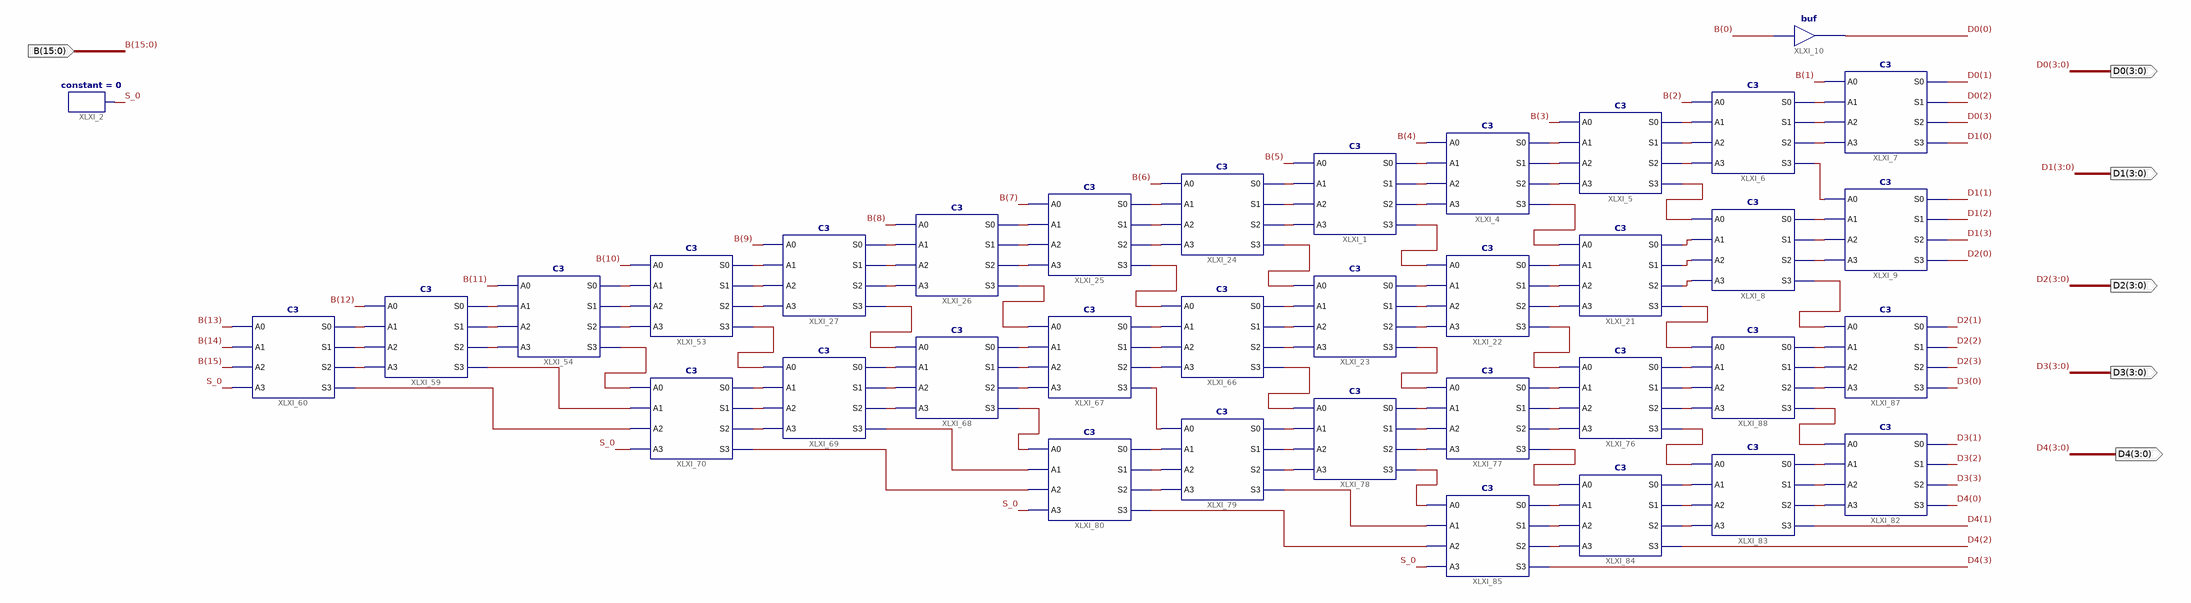
[diagram p0: schematic sheet 1]
// Xilinx ISE schematic bin2bcd_16.sch (spartan3e) as structural Verilog: 36 symbols, 6 ports
module bin2bcd_16 (
  input  [15:0] B,
  output [3:0] D1,
  output [3:0] D0,
  output [3:0] D2,
  output [3:0] D3,
  output [3:0] D4
);

  wire S_0, XLXN_22, XLXN_23, XLXN_24, XLXN_25, XLXN_26, XLXN_27, XLXN_28, XLXN_29, XLXN_30, XLXN_31,
       XLXN_32, XLXN_33, XLXN_39, XLXN_41, XLXN_42, XLXN_43, XLXN_134, XLXN_135, XLXN_136, XLXN_137,
       XLXN_138, XLXN_139, XLXN_140, XLXN_141, XLXN_142, XLXN_143, XLXN_144, XLXN_145, XLXN_146, XLXN_147,
       XLXN_148, XLXN_149, XLXN_150, XLXN_151, XLXN_152, XLXN_153, XLXN_154, XLXN_155, XLXN_156, XLXN_157,
       XLXN_186, XLXN_187, XLXN_188, XLXN_189, XLXN_190, XLXN_191, XLXN_192, XLXN_193, XLXN_194, XLXN_195,
       XLXN_196, XLXN_197, XLXN_198, XLXN_199, XLXN_200, XLXN_229, XLXN_230, XLXN_231, XLXN_232, XLXN_233,
       XLXN_234, XLXN_235, XLXN_236, XLXN_237, XLXN_238, XLXN_239, XLXN_240, XLXN_249, XLXN_250, XLXN_251,
       XLXN_252, XLXN_253, XLXN_254, XLXN_255, XLXN_256, XLXN_257, XLXN_271, XLXN_272, XLXN_273, XLXN_274,
       XLXN_275, XLXN_276, XLXN_294, XLXN_295, XLXN_296, XLXN_297, XLXN_298, XLXN_299, XLXN_300, XLXN_301,
       XLXN_302, XLXN_303, XLXN_304, XLXN_305, XLXN_306, XLXN_307, XLXN_308, XLXN_309, XLXN_310, XLXN_311,
       XLXN_312, XLXN_313, XLXN_314, XLXN_315, XLXN_316, XLXN_317, XLXN_318, XLXN_319, XLXN_320, XLXN_321,
       XLXN_322, XLXN_323, XLXN_335, XLXN_336, XLXN_337, XLXN_338, XLXN_339;

  constant #(.CValue("0")) XLXI_2 (.O(S_0));
  C3 XLXI_1 (
    .A0(B[5]), .A1(XLXN_155), .A2(XLXN_156), .A3(XLXN_157), .S3(XLXN_305), .S0(XLXN_22), .S1(XLXN_23),
    .S2(XLXN_24));
  C3 XLXI_4 (
    .A0(B[4]), .A1(XLXN_22), .A2(XLXN_23), .A3(XLXN_24), .S3(XLXN_304), .S0(XLXN_27), .S1(XLXN_26),
    .S2(XLXN_25));
  C3 XLXI_5 (
    .A0(B[3]), .A1(XLXN_27), .A2(XLXN_26), .A3(XLXN_25), .S3(XLXN_303), .S0(XLXN_28), .S1(XLXN_29),
    .S2(XLXN_30));
  C3 XLXI_6 (
    .A0(B[2]), .A1(XLXN_28), .A2(XLXN_29), .A3(XLXN_30), .S3(XLXN_39), .S0(XLXN_31), .S1(XLXN_32),
    .S2(XLXN_33));
  C3 XLXI_7 (.A0(B[1]), .A1(XLXN_31), .A2(XLXN_32), .A3(XLXN_33), .S3(D1[0]), .S0(D0[1]), .S1(D0[2]), .S2(D0[3]));
  C3 XLXI_8 (
    .A0(XLXN_303), .A1(XLXN_302), .A2(XLXN_301), .A3(XLXN_300), .S3(XLXN_322), .S0(XLXN_41), .S1(XLXN_42),
    .S2(XLXN_43));
  C3 XLXI_9 (.A0(XLXN_39), .A1(XLXN_41), .A2(XLXN_42), .A3(XLXN_43), .S3(D2[0]), .S0(D1[1]), .S1(D1[2]), .S2(D1[3]));
  buf XLXI_10 (D0[0], B[0]);
  C3 XLXI_21 (
    .A0(XLXN_304), .A1(XLXN_299), .A2(XLXN_298), .A3(XLXN_297), .S3(XLXN_321), .S0(XLXN_302), .S1(XLXN_301),
    .S2(XLXN_300));
  C3 XLXI_22 (
    .A0(XLXN_305), .A1(XLXN_294), .A2(XLXN_295), .A3(XLXN_296), .S3(XLXN_320), .S0(XLXN_299), .S1(XLXN_298),
    .S2(XLXN_297));
  C3 XLXI_23 (
    .A0(XLXN_306), .A1(XLXN_198), .A2(XLXN_199), .A3(XLXN_200), .S3(XLXN_319), .S0(XLXN_294), .S1(XLXN_295),
    .S2(XLXN_296));
  C3 XLXI_24 (
    .A0(B[6]), .A1(XLXN_152), .A2(XLXN_153), .A3(XLXN_154), .S3(XLXN_306), .S0(XLXN_155), .S1(XLXN_156),
    .S2(XLXN_157));
  C3 XLXI_25 (
    .A0(B[7]), .A1(XLXN_149), .A2(XLXN_150), .A3(XLXN_151), .S3(XLXN_307), .S0(XLXN_152), .S1(XLXN_153),
    .S2(XLXN_154));
  C3 XLXI_26 (
    .A0(B[8]), .A1(XLXN_146), .A2(XLXN_147), .A3(XLXN_148), .S3(XLXN_308), .S0(XLXN_149), .S1(XLXN_150),
    .S2(XLXN_151));
  C3 XLXI_27 (
    .A0(B[9]), .A1(XLXN_143), .A2(XLXN_144), .A3(XLXN_145), .S3(XLXN_310), .S0(XLXN_146), .S1(XLXN_147),
    .S2(XLXN_148));
  C3 XLXI_53 (
    .A0(B[10]), .A1(XLXN_140), .A2(XLXN_141), .A3(XLXN_142), .S3(XLXN_309), .S0(XLXN_143), .S1(XLXN_144),
    .S2(XLXN_145));
  C3 XLXI_54 (
    .A0(B[11]), .A1(XLXN_137), .A2(XLXN_138), .A3(XLXN_139), .S3(XLXN_311), .S0(XLXN_140), .S1(XLXN_141),
    .S2(XLXN_142));
  C3 XLXI_66 (
    .A0(XLXN_307), .A1(XLXN_195), .A2(XLXN_196), .A3(XLXN_197), .S3(XLXN_318), .S0(XLXN_198), .S1(XLXN_199),
    .S2(XLXN_200));
  C3 XLXI_67 (
    .A0(XLXN_308), .A1(XLXN_192), .A2(XLXN_193), .A3(XLXN_194), .S3(XLXN_317), .S0(XLXN_195), .S1(XLXN_196),
    .S2(XLXN_197));
  C3 XLXI_68 (
    .A0(XLXN_310), .A1(XLXN_189), .A2(XLXN_190), .A3(XLXN_191), .S3(XLXN_314), .S0(XLXN_192), .S1(XLXN_193),
    .S2(XLXN_194));
  C3 XLXI_69 (
    .A0(XLXN_309), .A1(XLXN_186), .A2(XLXN_187), .A3(XLXN_188), .S3(XLXN_315), .S0(XLXN_189), .S1(XLXN_190),
    .S2(XLXN_191));
  C3 XLXI_70 (
    .A0(XLXN_311), .A1(XLXN_312), .A2(XLXN_313), .A3(S_0), .S3(XLXN_316), .S0(XLXN_186), .S1(XLXN_187),
    .S2(XLXN_188));
  C3 XLXI_76 (
    .A0(XLXN_320), .A1(XLXN_238), .A2(XLXN_239), .A3(XLXN_240), .S3(XLXN_335), .S0(XLXN_271), .S1(XLXN_272),
    .S2(XLXN_273));
  C3 XLXI_77 (
    .A0(XLXN_319), .A1(XLXN_235), .A2(XLXN_236), .A3(XLXN_237), .S3(XLXN_336), .S0(XLXN_238), .S1(XLXN_239),
    .S2(XLXN_240));
  C3 XLXI_78 (
    .A0(XLXN_318), .A1(XLXN_232), .A2(XLXN_233), .A3(XLXN_234), .S3(XLXN_337), .S0(XLXN_235), .S1(XLXN_236),
    .S2(XLXN_237));
  C3 XLXI_79 (
    .A0(XLXN_317), .A1(XLXN_229), .A2(XLXN_230), .A3(XLXN_231), .S3(XLXN_338), .S0(XLXN_232), .S1(XLXN_233),
    .S2(XLXN_234));
  C3 XLXI_80 (
    .A0(XLXN_314), .A1(XLXN_315), .A2(XLXN_316), .A3(S_0), .S3(XLXN_339), .S0(XLXN_229), .S1(XLXN_230),
    .S2(XLXN_231));
  C3 XLXI_82 (
    .A0(XLXN_323), .A1(XLXN_255), .A2(XLXN_256), .A3(XLXN_257), .S3(D4[0]), .S0(D3[1]), .S1(D3[2]), .S2(D3[3]));
  C3 XLXI_83 (
    .A0(XLXN_335), .A1(XLXN_252), .A2(XLXN_253), .A3(XLXN_254), .S3(D4[1]), .S0(XLXN_255), .S1(XLXN_256),
    .S2(XLXN_257));
  C3 XLXI_84 (
    .A0(XLXN_336), .A1(XLXN_249), .A2(XLXN_250), .A3(XLXN_251), .S3(D4[2]), .S0(XLXN_252), .S1(XLXN_253),
    .S2(XLXN_254));
  C3 XLXI_85 (
    .A0(XLXN_337), .A1(XLXN_338), .A2(XLXN_339), .A3(S_0), .S3(D4[3]), .S0(XLXN_249), .S1(XLXN_250),
    .S2(XLXN_251));
  C3 XLXI_87 (
    .A0(XLXN_322), .A1(XLXN_274), .A2(XLXN_275), .A3(XLXN_276), .S3(D3[0]), .S0(D2[1]), .S1(D2[2]), .S2(D2[3]));
  C3 XLXI_88 (
    .A0(XLXN_321), .A1(XLXN_271), .A2(XLXN_272), .A3(XLXN_273), .S3(XLXN_323), .S0(XLXN_274), .S1(XLXN_275),
    .S2(XLXN_276));
  C3 XLXI_60 (.A0(B[13]), .A1(B[14]), .A2(B[15]), .A3(S_0), .S3(XLXN_313), .S0(XLXN_134), .S1(XLXN_135), .S2(XLXN_136));
  C3 XLXI_59 (
    .A0(B[12]), .A1(XLXN_134), .A2(XLXN_135), .A3(XLXN_136), .S3(XLXN_312), .S0(XLXN_137), .S1(XLXN_138),
    .S2(XLXN_139));
endmodule
